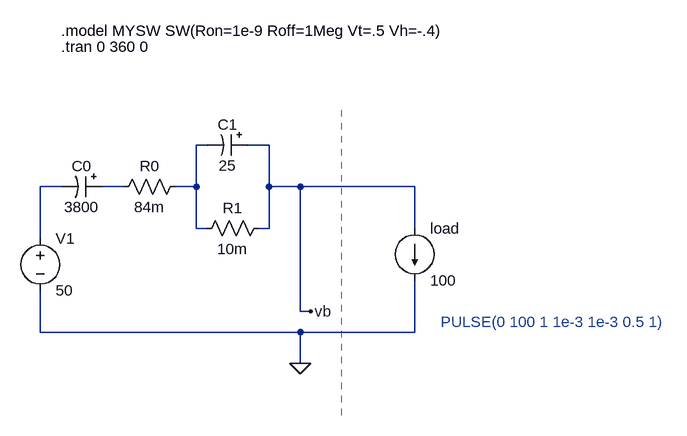
[diagram p0: schematic pngv_model.asc]
pngv_model.asc, the LTspice schematic file:
Version 4
SHEET 1 1192 680
WIRE 432 -16 416 -16
WIRE 528 -16 496 -16
WIRE 208 48 176 48
WIRE 304 48 272 48
WIRE 416 48 416 -16
WIRE 416 48 384 48
WIRE 528 48 528 -16
WIRE 576 48 528 48
WIRE 752 48 576 48
WIRE 416 112 416 48
WIRE 432 112 416 112
WIRE 528 112 528 48
WIRE 528 112 512 112
WIRE 752 112 752 48
WIRE 176 128 176 48
WIRE 576 240 576 48
WIRE 592 240 576 240
WIRE 176 272 176 208
WIRE 576 272 176 272
WIRE 752 272 752 192
WIRE 752 272 576 272
WIRE 576 320 576 272
FLAG 576 320 0
FLAG 592 240 vb
SYMBOL voltage 176 112 R0
WINDOW 123 0 0 Left 0
WINDOW 39 0 0 Left 0
SYMATTR InstName V1
SYMATTR Value 50
SYMBOL res 400 32 R90
WINDOW 0 0 56 VBottom 2
WINDOW 3 32 56 VTop 2
SYMATTR InstName R0
SYMATTR Value 84m
SYMBOL res 528 96 R90
WINDOW 0 0 56 VBottom 2
WINDOW 3 32 56 VTop 2
SYMATTR InstName R1
SYMATTR Value 10m
SYMBOL polcap 272 32 R90
WINDOW 0 0 32 VBottom 2
WINDOW 3 32 32 VTop 2
SYMATTR InstName C0
SYMATTR Value 3800
SYMATTR SpiceLine IC=0
SYMBOL polcap 496 -32 R90
WINDOW 0 0 32 VBottom 2
WINDOW 3 32 32 VTop 2
SYMATTR InstName C1
SYMATTR Value 25
SYMBOL current 752 112 R0
WINDOW 123 0 0 Left 0
WINDOW 39 0 0 Left 0
SYMATTR InstName load
SYMATTR Value 100
TEXT 208 -168 Left 2 !.tran 0 360 0
TEXT 208 -192 Left 2 !.model MYSW SW(Ron=1e-9 Roff=1Meg Vt=.5 Vh=-.4)
TEXT 792 256 Left 2 ;PULSE(0 100 1 1e-3 1e-3 0.5 1)
LINE Normal 640 400 640 -80 2

The netlist it stands for:
* pngv_model.asc
V1 N002 0 50
R0 N001 N003 84m
R1 vb N001 10m
C0 N003 N002 3800 IC=0
C1 vb N001 25
I§load vb 0 100
.tran 0 360 0
.model MYSW SW(Ron=1e-9 Roff=1Meg Vt=.5 Vh=-.4)
* PULSE(0 100 1 1e-3 1e-3 0.5 1)
.backanno
.end